# Altium schematic sheet Antenna_Switch_HP.SchDoc
size A; SheetNumber: 11; SheetTotal: 12; PageSetup: Record=PageOptions|CenterHorizontal=True|CenterVertical=True|PrintScale=0.97|XCorrection=1.00|YCorrection=1.00|PrintKind=0|BorderSize=5000000|LeftOffset=0|BottomOffset=0|Orientation=2|PaperLength=1000|PaperWidth=1000|Scale=100|PaperSource=7|PrintQuality=-4|MediaType=1|DitherType=10|PaperKind=A4|PrintScaleMode=1
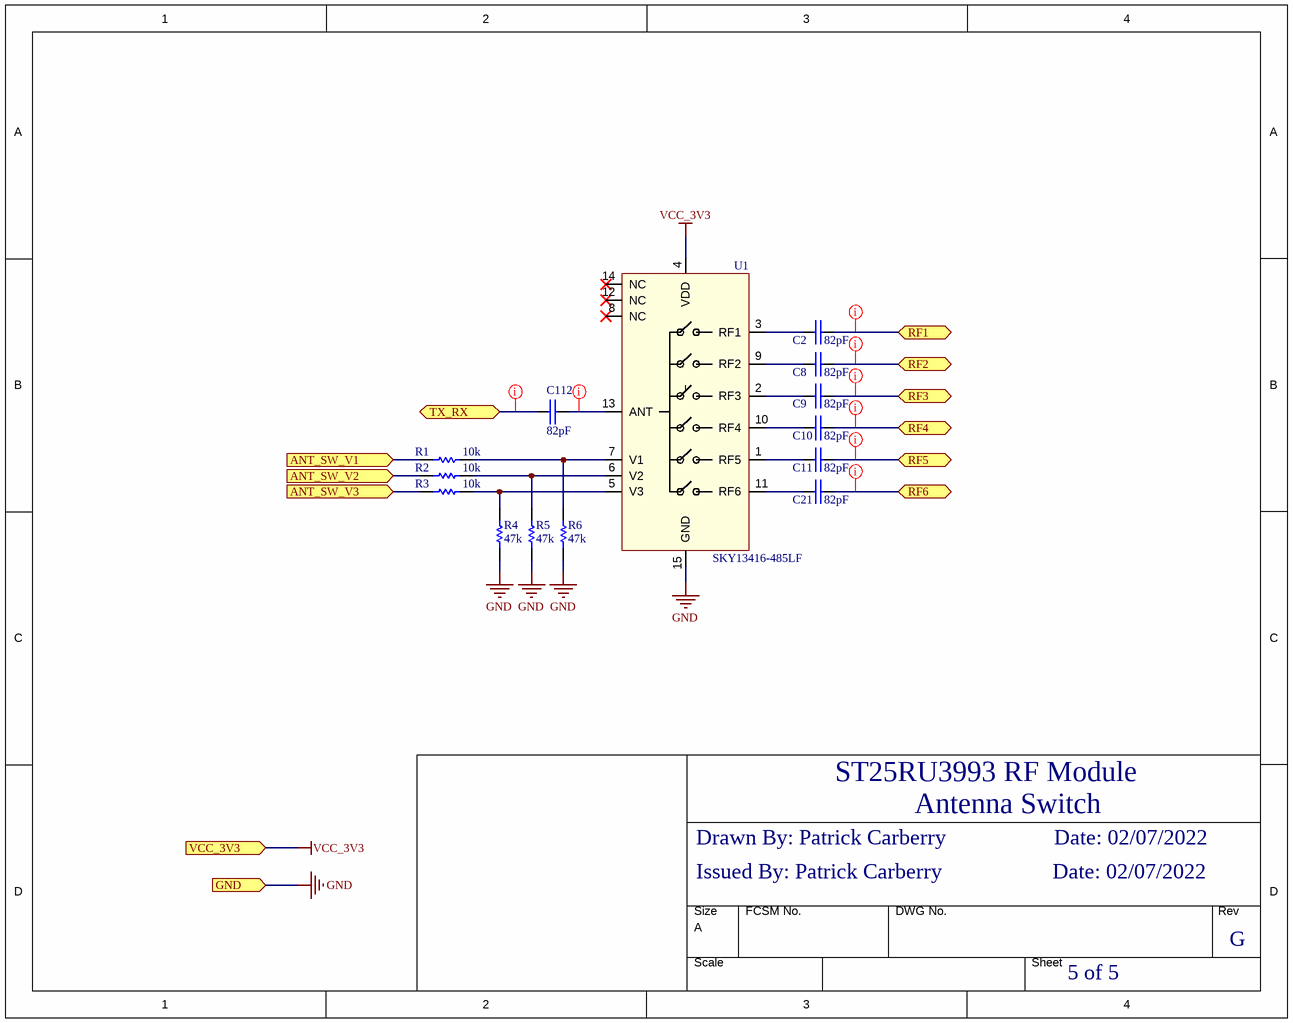
[diagram p0: Antenna_Switch_HP.SchDoc]

## Parts
C2  82pF  [C0402-RF]
C8  82pF  [C0402-RF]
C9  82pF  [C0402-RF]
C10  82pF  [C0402-RF]
C11  82pF  [C0402-RF]
C21  82pF  [C0402-RF]
C112  82pF  [C0402-RF]
R1  10k  [R0402-RF]
R2  10k  [R0402-RF]
R3  10k  [R0402-RF]
R4  47k  [R0402-RF]
R5  47k  [R0402-RF]
R6  47k  [R0402-RF]
U1  SKY13416-485LF  [SKY13416485LF]

## Ports
ANT_SW_V1 (in), ANT_SW_V2 (in), ANT_SW_V3 (in), GND (in), RF1 (bidir), RF2 (bidir), RF3 (bidir), RF4 (bidir), RF5 (bidir), RF6 (bidir), TX_RX (bidir), VCC_3V3 (in)

## Nets
GND: R4.1 R5.1 R6.1 U1.15(GND) ; port GND
VCC_3V3: U1.4(VDD) ; port VCC_3V3
ANT_SW_V1: R1.1 ; port ANT_SW_V1
ANT_SW_V2: R2.1 ; port ANT_SW_V2
ANT_SW_V3: R3.1 ; port ANT_SW_V3
RF1: C2.2 ; port RF1
RF2: C8.2 ; port RF2
RF3: C9.2 ; port RF3
RF4: C10.2 ; port RF4
RF5: C11.2 ; port RF5
RF6: C21.2 ; port RF6
TX_RX: C112.2 ; port TX_RX
NetC2_1: C2.1 U1.3(RF1)
NetC8_1: C8.1 U1.9(RF2)
NetC9_1: C9.1 U1.2(RF3)
NetC10_1: C10.1 U1.10(RF4)
NetC11_1: C11.1 U1.1(RF5)
NetC21_1: C21.1 U1.11(RF6)
NetC112_1: C112.1 U1.13(ANT)
NetR1_2: R1.2 R6.2 U1.7(V1)
NetR2_2: R2.2 R5.2 U1.6(V2)
NetR3_2: R3.2 R4.2 U1.5(V3)

Not connected (* = marked no-connect by the designer): U1 8(NC)* 12(NC)* 14(NC)*

## Layout directives
net class SE_CPWG: NetC112_1, RF1, RF2, RF3, RF4, RF5, RF6, TX_RX

## Notes on the sheet
- ST25RU3993 RF Module
- Antenna Switch
- Drawn By: Patrick Carberry
- Issued By: Patrick Carberry
- Date: 02/07/2022
- G
- 5 of 5

## Library data of the parts
C2 C8-C11 C21 C112 = GRM1555C1H820GA01J: CAP CER 82PF 50V C0G/NP0 0402; Manufacturer: Murata Electronics North America; Tolerance: ±2%; Temperature Coefficient: C0G, NP0; Filter Type: Signal Line; Number of Lines: 1; Impedance @ Frequency: 1 kOhm @ 100MHz; Current Rating (Max): 250mA; DC Resistance (DCR) (Max): 1.1 Ohm; Type: Zener; Voltage - Reverse Standoff (Typ): 3V; Voltage - Breakdown (Min): 6V; Voltage - Clamping (Max) @ Ipp: 17V; Current - Peak Pulse (10/1000µs): 1A (8/20µs); Power - Peak Pulse: 40W; Power Line Protection: No; Capacitance @ Frequency: 0.4pF @ 200MHz ~ 3GHz; Supplier 1: Digi-Key; Supplier Part Number 1: 490-7760-1-ND; Manufacturer Part Number: GRM1555C1H820GA01J; RoHS: RoHS Compliant; Category: Capacitors; Stock: 52112; Pricing: 1=0.08, 10=0.042, 100=0.0189, 500=0.01352, 1000=0.01063, 2500=0.00966, 5000=0.00889 (EUR); Packaging: Cut Tape (CT); Part Status: Active; Voltage - Rated: 50V; Operating Temperature: -55°C ~ 125°C; Features: -; Ratings: -; Applications: General Purpose; Mounting Type: Surface Mount, MLCC; Package / Case: 0402 (1005 Metric); Size / Dimension: 0.039" L x 0.020" W (1.00mm x 0.50mm); Height - Seated (Max): -; Thickness (Max): 0.022" (0.55mm); Lead Spacing: -; Lead Style: -; ComponentLink1URL: http://www.murata.com/~/media/webrenewal/support/library/catalog/products/capacitor/mlcc/c02e.ashx; ComponentLink1Description: http://www.murata.com/~/media/webrenewal/support/library/catalog/products/capacitor/mlcc/c02e.ashx; Supplier 2: Digi-Key; Supplier Part Number 2: 490-3999-1-ND; Height (Max): 0.022" (0.55mm); ComponentLink2URL: http://www.murata.com/en-global/products/productdata/8796740223006/ENFA0024.pdf; ComponentLink2Description: http://www.murata.com/en-global/products/productdata/8796740223006/ENFA0024.pdf; Supplier 3: Digi-Key; Supplier Part Number 3: 497-13413-1-ND; Supplier Device Package: SOD-882T; ComponentLink3URL: http://www.st.com/content/ccc/resource/technical/document/datasheet/e8/d2/ed/fd/e8/00/4a/29/DM00065056.pdf/files/DM00065056.pdf/jcr:content/translations/en.DM00065056.pdf; ComponentLink3Description: http://www.st.com/content/ccc/resource/technical/document/datasheet/e8/d2/ed/fd/e8/00/4a/29/DM00065056.pdf/files/DM00065056.pdf/jcr:content/translations/en.DM00065056.pdf; Exact Component Match: no
R1-R3 = RC0402FR-0710KL: RES SMD 10K OHM 1% 1/16W 0402; Manufacturer 1: Yageo; Power (Watts): 0.063W, 1/16W; Temperature Coefficient: ±100ppm/°C; Exact Component Match: no; Supplier 1: Digi-Key; Supplier Part Number 1: 311-10.0KLRCT-ND; Manufacturer Part Number 1: RC0402FR-0710KL; RoHS: RoHS Compliant; Category: Resistors; Stock 1: 12117181; Pricing 1: 1=0.09, 10=0.012, 25=0.0088, 100=0.0049, 250=0.00372, 500=0.00296, 1000=0.00218, 2500=0.00189, 5000=0.00156 (EUR); Packaging: Cut Tape (CT); Part Status: Active; Resistance (Ohms): 10k; Tolerance: ±1%; Composition: Thick Film; Features: Moisture Resistant; Operating Temperature: -55°C ~ 155°C; Package / Case: 0402 (1005 Metric); Supplier Device Package: 0402; Size / Dimension: 0.039" L x 0.020" W (1.00mm x 0.50mm); Height - Seated (Max): 0.016" (0.40mm); Number of Terminations: 2; Failure Rate: -; ComponentLink1URL: http://www.yageo.com/NewPortal/yageodocoutput?fileName=/pdf/R-Chip/PYu-RC_Group_51_RoHS_L_4.pdf; ComponentLink1Description: http://www.yageo.com/NewPortal/yageodocoutput?fileName=/pdf/R-Chip/PYu-RC_Group_51_RoHS_L_4.pdf; Manufacturer: Yageo; Manufacturer Part Number: RC0402FR-0710KL
R4-R6 = RC0402FR-0747KL: RES SMD 47K OHM 1% 1/16W 0402; Manufacturer 1: Yageo; Power (Watts): 0.063W, 1/16W; Temperature Coefficient: ±100ppm/°C; Exact Component Match: no; Supplier 1: Digi-Key; Supplier Part Number 1: 311-47.0KLRCT-ND; Manufacturer Part Number 1: RC0402FR-0747KL; RoHS: RoHS Compliant; Category: Resistors; Stock 1: 2403458; Pricing 1: 1=0.09, 10=0.012, 25=0.0088, 100=0.0049, 250=0.00372, 500=0.00296, 1000=0.00218, 2500=0.00189, 5000=0.00156 (EUR); Packaging: Cut Tape (CT); Part Status: Active; Resistance (Ohms): 47k; Tolerance: ±1%; Composition: Thick Film; Features: Moisture Resistant; Operating Temperature: -55°C ~ 155°C; Package / Case: 0402 (1005 Metric); Supplier Device Package: 0402; Size / Dimension: 0.039" L x 0.020" W (1.00mm x 0.50mm); Height - Seated (Max): 0.016" (0.40mm); Number of Terminations: 2; Failure Rate: -; ComponentLink1URL: http://www.yageo.com/NewPortal/yageodocoutput?fileName=/pdf/R-Chip/PYu-RC_Group_51_RoHS_L_4.pdf; ComponentLink1Description: http://www.yageo.com/NewPortal/yageodocoutput?fileName=/pdf/R-Chip/PYu-RC_Group_51_RoHS_L_4.pdf; Manufacturer: Yageo; Manufacturer Part Number: RC0402FR-0747KL
U1 = SKY13416-485LF: RF Switch IC SP6T 3GHz 50Ohm 14-QFN (2x2); Manufacturer: Skyworks Solutions; Manufacturer Part Number: SKY13416-485LF; ComponentLink1Description: Datasheet; ComponentLink1URL: https://www.skyworksinc.com/-/media/SkyWorks/Documents/Products/701-800/SKY13416_485LF_201679I.pdf